# EAGLE design businessCard (EAGLE 7.4.0)
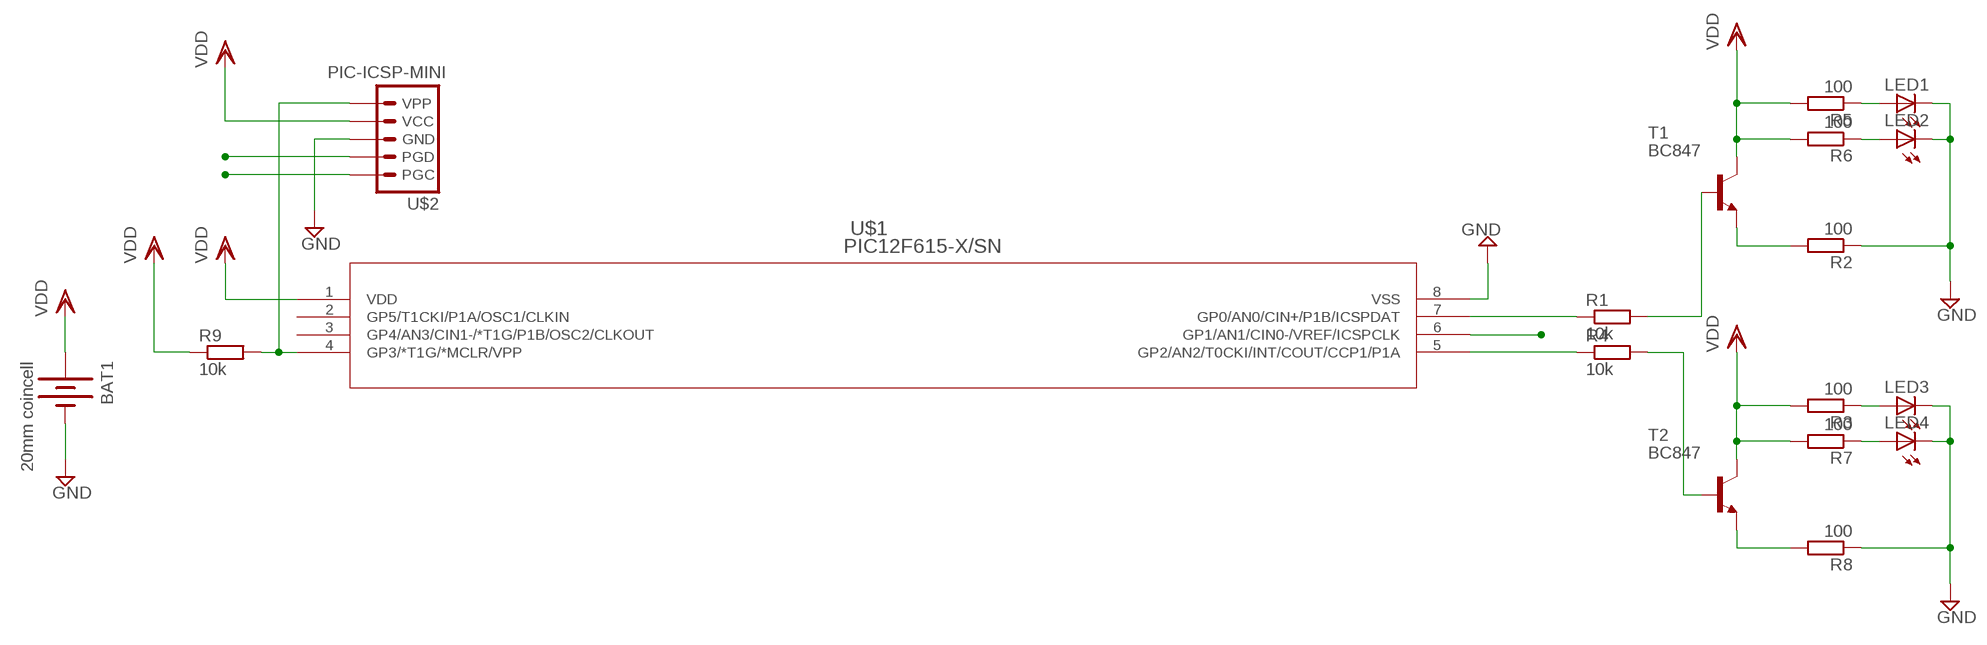
[diagram p0: schematic, sheet 1]

## Parts
BAT1  20mm coincell  BATTERY20MM_4LEGS  [BATTCON_20MM_4LEGS]
LED1  LEDCHIPLED_0805  [CHIPLED_0805]
LED2  LEDCHIPLED_0805  [CHIPLED_0805]
LED3  LEDCHIPLED_0805  [CHIPLED_0805]
LED4  LEDCHIPLED_0805  [CHIPLED_0805]
R1  10k  R-EU_R0805  [R0805]
R2  100  R-EU_R0805  [R0805]
R3  100  R-EU_R0805  [R0805]
R4  10k  R-EU_R0805  [R0805]
R5  100  R-EU_R0805  [R0805]
R6  100  R-EU_R0805  [R0805]
R7  100  R-EU_R0805  [R0805]
R8  100  R-EU_R0805  [R0805]
R9  10k  R-EU_R0805  [R0805]
T1  BC847  [SOT23]
T2  BC847  [SOT23]
U$1  PIC12F615-X/SN  [SOIC8-N_MC]
U$2  PIC-ICSP-MINI  [PIC-ICSP-MINI]

## Nets
GND: BAT1.2(-) LED1.C LED2.C LED3.C LED4.C R2.1 R8.1 U$1.8(VSS) U$2.3(GND)
ICSPCLK: U$1.6(GP1/AN1/CIN0-/VREF/ICSPCLK) U$2.5(PGC)
ICSPDAT: R1.1 U$1.7(GP0/AN0/CIN+/P1B/ICSPDAT) U$2.4(PGD)
N$1: R4.1 U$1.5(GP2/AN2/T0CKI/INT/COUT/CCP1/P1A)
N$2: R9.2 U$1.4(GP3/*T1G/*MCLR/VPP) U$2.1(VPP)
N$3: R4.2 T2.1(B)
N$4: LED1.A R5.1
N$5: R2.2 T1.2(E)
N$6: R1.2 T1.1(B)
N$7: LED2.A R6.1
N$8: LED3.A R3.1
N$9: LED4.A R7.1
N$10: R8.2 T2.2(E)
VDD: BAT1.1(+) R3.2 R5.2 R6.2 R7.2 R9.1 T1.3(C) T2.3(C) U$1.1(VDD) U$2.2(VCC)
Unconnected: U$1.2(GP5/T1CKI/P1A/OSC1/CLKIN) U$1.3(GP4/AN3/CIN1-/*T1G/P1B/OSC2/CLKOUT)

## Library data of the parts
BAT1 = SparkFun-Electromechanical:BATTERY: Battery Holders Various common sizes : AA, AAA, 18650 (PRT-12895), 20mm coin cell and 12mm coin cell. 20MM_4LEGS, BATT-10373; PROD_ID: BATT-10373
LED1-LED4 = led:LED: LED OSRAM: - CHIPLED LG R971, LG N971, LY N971, LG Q971, LY Q971, LO R971, LY R971 LH N974, LH R974 LS Q976, LO Q976, LY Q976 LO Q996 - Hyper CHIPLED LW Q18S LB Q993, LB Q99A, LB R99A - SideLED LS A670, LO A670, LY A670, LG A670, LP A670 LB A673, LV A673, LT A673, LW A673 LH A674 LY A675 LS A676, LA A676, LO A676, LY A676, LW A676 LS A679, LY A679, LG A679 - Hyper Micro SIDELED® LS Y876, LA Y876, LO Y876, LY Y876 LT Y87S - SmartLED LW L88C, LW L88S LB L89C, LB L89S, LG L890 LS L89K, LO L89K, LY L89K LS L896, LA L896, LO L896, LY L896 - TOPLED LS T670, LO T670, LY T670, LG T670, LP T670 LSG T670, LSP T670, LSY T670, LOP T670, LYG T670 LG T671, LOG T671, LSG T671 LB T673, LV T673, LT T673, LW T673 LH T674 LS T676, LA T676, LO T676, LY T676, LB T676, LH T676, LSB T676, LW T676 LB T67C, LV T67C, LT T67C, LS T67K, LO T67K, LY T67K, LW E67C LS E67B, LA E67B, LO E67B, LY E67B, LB E67C, LV E67C, LT E67C LW T67C LS T679, LY T679, LG T679 LS T770, LO T770, LY T770, LG T770, LP T770 LB T773, LV T773, LT T773, LW T773 LH T774 LS E675, LA E675, LY E675, LS T675 LS T776, LA T776, LO T776, LY T776, LB T776 LHGB T686 LT T68C, LB T68C - Hyper Mini TOPLED® LB M676 - Mini TOPLED Santana® LG M470 LS M47K, LO M47K, LY M47K Source: http://www.osram.convergy.de LUXEON: - LUMILED® LXK2-PW12-R00, LXK2-PW12-S00, LXK2-PW14-U00, LXK2-PW14-V00 LXK2-PM12-R00, LXK2-PM12-S00, LXK2-PM14-U00 LXK2-PE12-Q00, LXK2-PE12-R00, LXK2-PE12-S00, LXK2-PE14-T00, LXK2-PE14-U00 LXK2-PB12-K00, LXK2-PB12-L00, LXK2-PB12-M00, LXK2-PB14-N00, LXK2-PB14-P00, LXK2-PB14-Q00 LXK2-PR12-L00, LXK2-PR12-M00, LXK2-PR14-Q00, LXK2-PR14-R00 LXK2-PD12-Q00, LXK2-PD12-R00, LXK2-PD12-S00 LXK2-PH12-R00, LXK2-PH12-S00 LXK2-PL12-P00, LXK2-PL12-Q00, LXK2-PL12-R00 Source: www.luxeon.com KINGBRIGHT: KA-3528ASYC Source: www.kingbright.com
R1-R9 = rcl:R-EU_: RESISTOR, European symbol
T1 T2 = transistor:BC847: NPN TRANSISTOR
U$1 = pic12f615:PIC12F615-X/SN
U$2 = SparkFun-Connectors:PIC-ICSP-MINI: PIC-ICSP-Mini Miniature 5-pin connection for temporary programming of PICs. Use this device in your design to save space. Program the PIC with this adapter Spark Fun Electronics SKU : BOB-00194

## Board
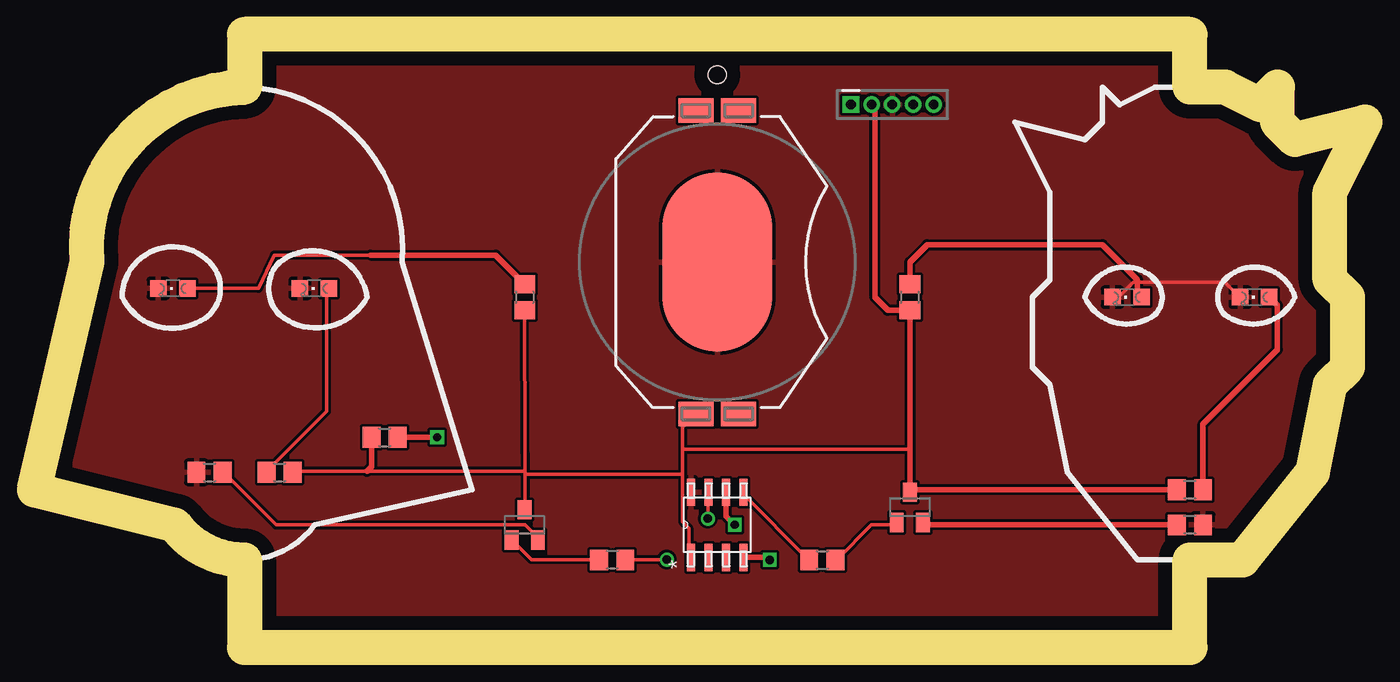
[diagram p1: board, top side]
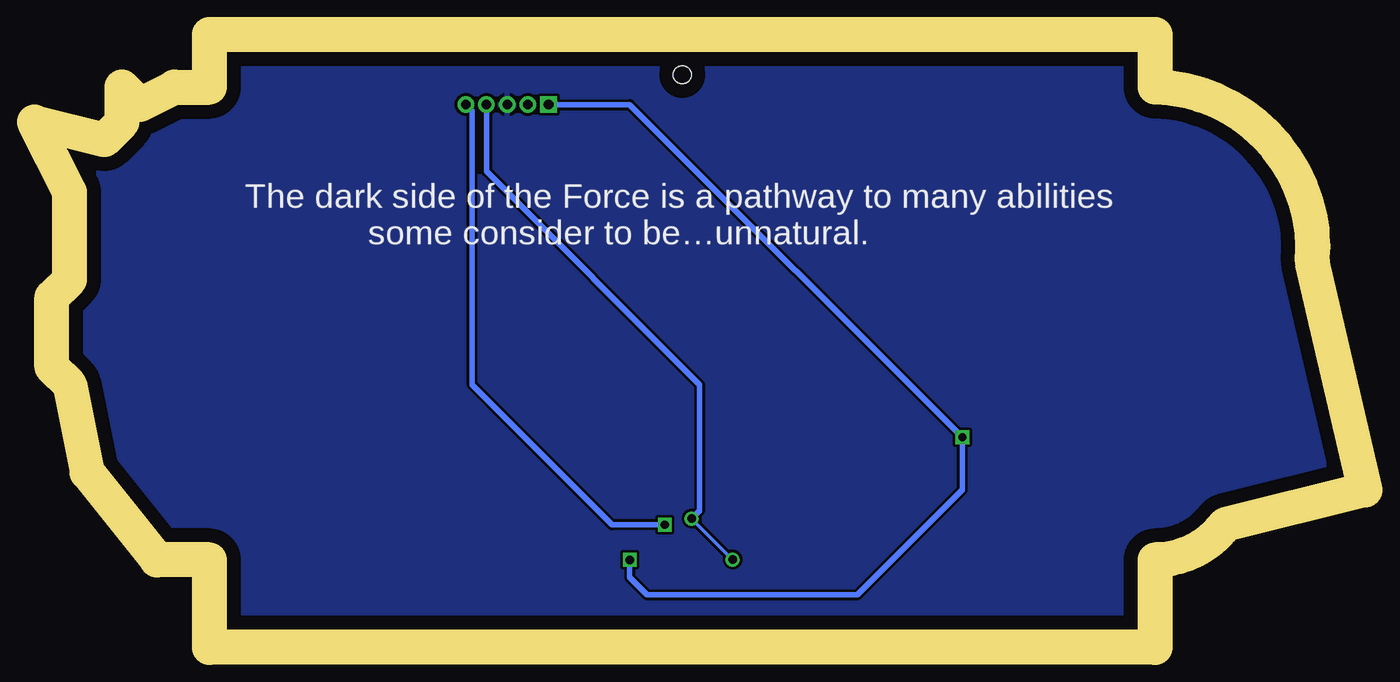
[diagram p2: board, bottom side, seen from below]

Size 96.52 x 44.45 mm. Coordinates in mm from the lower left corner, seen from the top.
Outline: 0,11.43 10.16,8.89 arc53 15.24,6.35 15.24,0 83.82,0 83.82,6.35 87.63,6.35 92.71,12.7 93.98,19.05 95.25,20.32 95.25,25.4 93.98,26.67 93.98,33.02 96.52,38.1 91.44,36.83 90.17,38.1 90.17,40.64 88.9,39.37 86.36,40.64 83.82,40.64 83.82,44.45 15.24,44.45 15.24,40.64 arc93 3.81,27.94 0,11.43
Copper layers (1*16): Top 0.035mm / dielectric 1.5mm / Bottom 0.035mm
Design rules "default": minimum track width 10mil, minimum drill 24mil, track to track 8mil, track to pad 8mil, pad to pad 8mil, via to via 8mil, smd to smd 8mil, copper to edge 40mil, drill to drill 8mil, minimum pad ring 10mil, minimum via ring 8mil, stop-mask expansion 4mil, vias tented up to drill 0mil, thermal gap 10mil
Holes 1.3 mm at 49.53,41.53

### Footprints (pad centres in the part's own frame; a part is rotated, then mirrored left to right if it is on the bottom)
BATTCON_20MM_4LEGS = smd 1.778 x 2.54: 1 -11,1.55; 3 11,1.55; P$1 -11,-1.55; P$2 11,-1.55 | smd 13 x 8: 2 0,0
CHIPLED_0805 = smd 1.2 x 1.2: A 0,-1.05; C 0,1.05
R0805 = smd 1.3 x 1.5: 1 -0.95,0; 2 0.95,0
SOT23 = smd 1 x 1.4: 1 -0.95,-1.1; 2 0.95,-1.1; 3 0,1.1
SOIC8-N_MC = smd 1.981 x 0.559: 1 -2.362,1.905; 2 -2.362,0.635; 3 -2.362,-0.635; 4 -2.362,-1.905; 5 2.362,-1.905; 6 2.362,-0.635; 7 2.362,0.635; 8 2.362,1.905
PIC-ICSP-MINI = drill 0.7 square: 1 -3,0 | drill 0.7: 2 -1.5,0; 3 0,0; 4 1.5,0; 5 3,0

### Placement (x,y rotation side)
BAT1  49.53,27.94 90 top
LED1  10.03,26.04 90 top
LED2  20.32,26.04 90 top
LED3  79.25,25.4 90 top
LED4  88.52,25.4 90 top
R1  41.91,6.35 180 top
R2  12.7,12.7 0 top
R3  63.5,25.4 270 top
R4  57.15,6.35 0 top
R5  35.56,25.4 270 top
R6  17.78,12.7 0 top
R7  83.82,11.43 180 top
R8  83.82,8.89 180 top
R9  25.4,15.24 0 top
T1  35.56,8.89 0 top
T2  63.5,10.16 0 top
U$1  49.53,8.89 90 top
U$2  62.23,39.37 0 top

### Tracks (layer width: path | path; a pad name or v marks a point on that pad's centre or on a via)
GND
  Top 0.254: LED3.C 78.33,25.58 78.79,25.58 79.7,26.49 86.33,26.49 87.25,25.58 LED4.C
  pour Top: 0,-2.54 97.79,-2.54 97.79,45.72 1.27,45.72
  pour Bottom: 0,-2.54 97.79,-2.54 97.79,45.72 1.27,45.72
ICSPCLK  (via drill 0.6)
  Top 0.406: U$1.6 50.16,9.52 v50.8,8.89
  Bottom 0.406: v50.8,8.89 54.61,8.89 64.77,19.05 64.77,38.91 U$2.5
ICSPDAT  (via drill 0.61)
  Top 0.254: 48.84,10.72 48.84,11.18 U$1.7 48.84,10.72 | v45.87,6.37 42.9,6.37 R1.1 | 48.84,10.72 v48.84,9.35
  Bottom 0.254: v48.84,9.35 v45.87,6.37
  Bottom 0.406: U$2.4 63.73,34.52 48.26,19.05 48.26,9.93 v48.84,9.35
N$1
  Top 0.254: R4.1 56.16,6.37 51.36,11.18 U$1.5
N$2  (via drill 0.6)
  Top 0.406: U$1.4 53.16,6.53 v53.34,6.35 | v29.21,15.24 R9.2
  Bottom 0.406: v53.34,6.35 53.34,5.08 52.07,3.81 36.83,3.81 29.21,11.43 v29.21,15.24 53.34,39.37 U$2.1
N$3
  Top 0.254: T2.1 62.33,8.89 60.73,8.89 58.22,6.37 R4.2
N$4
  Top 0.254: LED1.A 16.26,26.04 17.4,28.45 24.38,28.45
  Top 0.406: 24.38,28.45 33.46,28.45 R5.1
N$5
  Top 0.254: T1.2 36.5,7.98 35.59,8.89 17.53,8.89 13.87,12.55 R2.2
N$6
  Top 0.254: T1.1 34.67,7.75 36.04,6.37 40.84,6.37 R1.2
N$7
  Top 0.254: LED2.A 21.18,26.04 21.18,17.12 16.84,12.78 R6.1
N$8
  Top 0.406: R3.1 63.5,27.94 64.77,29.21 77.47,29.21 80.01,26.67 80.01,25.69 LED3.A
N$9
  Top 0.406: R7.1 84.77,16.19 90.17,21.59 90.17,24.8 LED4.A
N$10
  Top 0.406: R8.2 64.62,8.89 T2.2
VDD
  Top 0.254: 47.02,14.38 47.02,15.98 47.93,16.89 BAT1.1 | 47.02,14.38 47.02,12.55 | 47.02,12.55 47.02,9.12 47.47,8.66 47.47,6.6 U$1.1 | 35.59,12.78 35.59,14.15 R5.2 | 35.59,12.78 35.59,12.55 | 35.59,12.55 35.59,10.03 T1.3 | 35.59,12.78 24.13,12.78 18.9,12.78 R6.2 | 35.59,12.55 47.02,12.55 | 47.02,14.38 63.48,14.38 R3.2
  Top 0.406: R7.2 63.67,11.43 T2.3 R3.2 61.91,24.45 60.96,25.4 60.96,39.14 U$2.2 | R9.1 24.45,13.1 24.13,12.78

### Text on the board
bPlace: The dark side of the Force is a pathway to many abilities / some consider to be…unnatural.